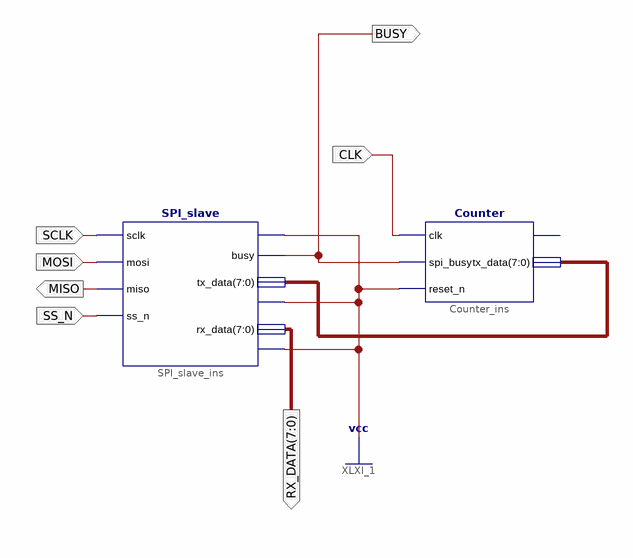
[diagram p0: schematic sheet 1]
// Xilinx ISE schematic Dummy_SPI.sch (spartan3e) as structural Verilog: 2 symbols, 7 ports
module Dummy_SPI (
  input  SCLK,
  input  MOSI,
  input  CLK,
  input  SS_N,
  output MISO,
  output BUSY,
  output [7:0] RX_DATA
);

  wire [7:0] XLXN_2;

  SPI_slave SPI_slave_ins (
    .sclk(SCLK), .mosi(MOSI), .ss_n(SS_N), .rx_data_request(1'b1), .tx_data_load_en(1'b1), .reset_n(1'b1),
    .tx_data(XLXN_2), .miso(MISO), .busy(BUSY), .rx_data(RX_DATA));
  Counter Counter_ins (.clk(CLK), .spi_busy(BUSY), .reset_n(1'b1), .tx_data(XLXN_2));  // open: tx_data_load_en
endmodule
